# Altium schematic sheet Tray2_Comms.SchDoc
size A4
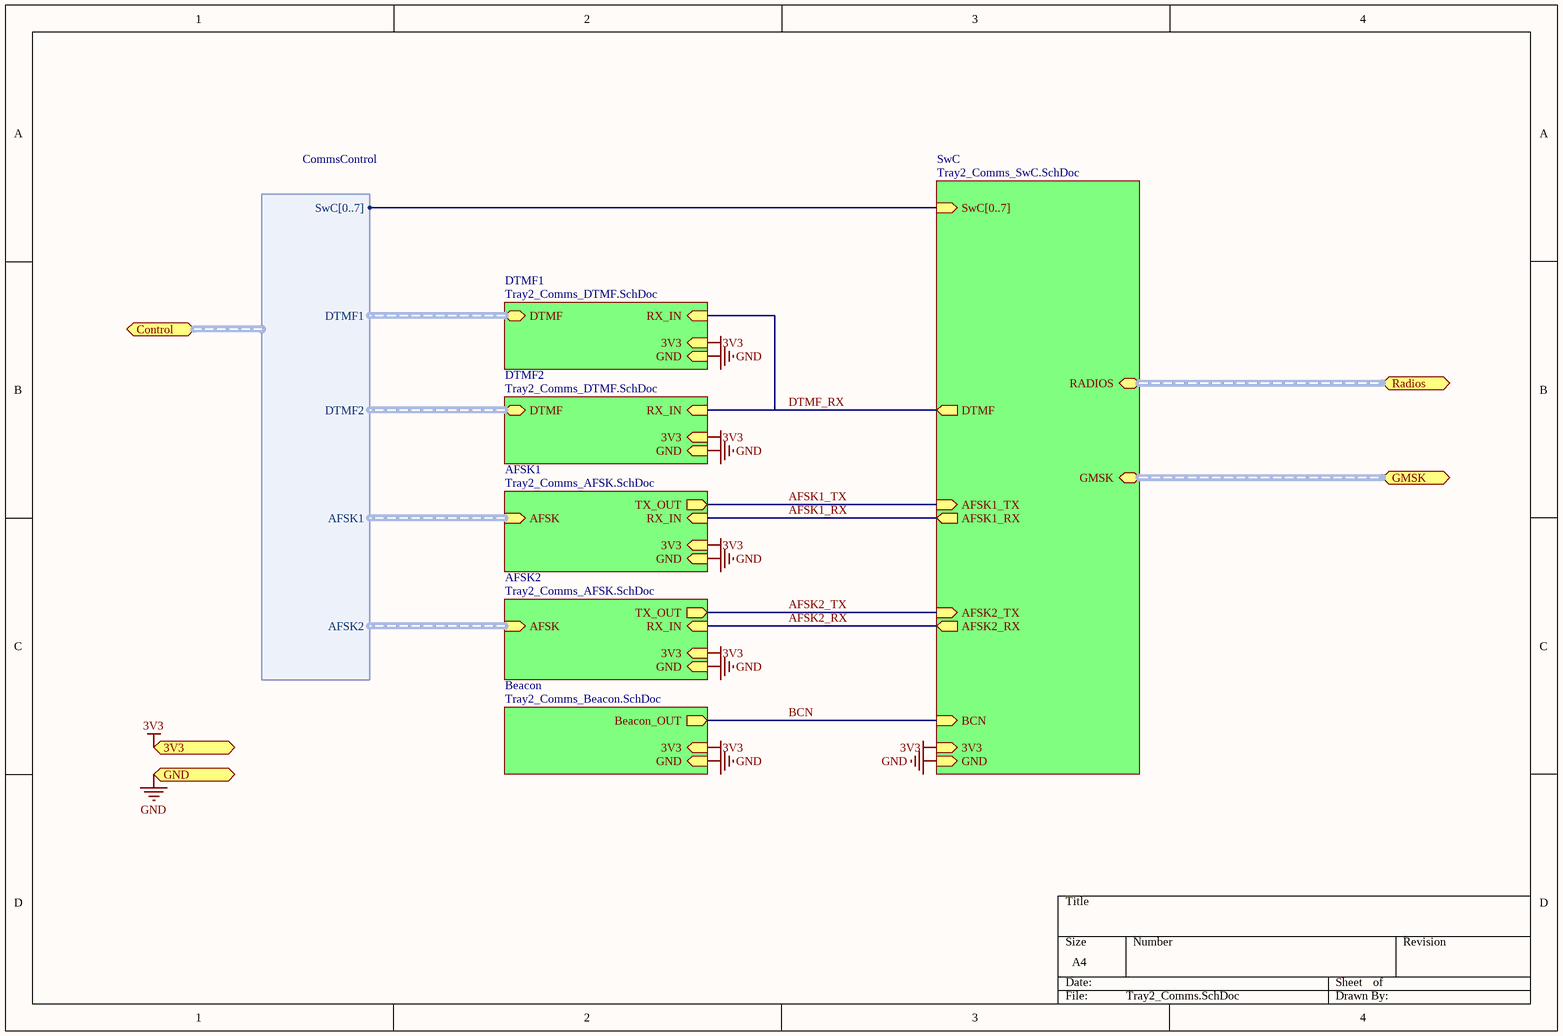
[diagram p0: Tray2_Comms.SchDoc]

## Sub-sheets
AFSK1 = Tray2_Comms_AFSK.SchDoc: RX_IN (in), AFSK (harness AFSK), TX_OUT (out), 3V3 (in), GND (in)
AFSK2 = Tray2_Comms_AFSK.SchDoc: RX_IN (in), AFSK (harness AFSK), TX_OUT (out), 3V3 (in), GND (in)
Beacon = Tray2_Comms_Beacon.SchDoc: Beacon_OUT (out), 3V3 (in), GND (in)
DTMF1 = Tray2_Comms_DTMF.SchDoc: RX_IN (in), DTMF (harness DTMF), 3V3 (in), GND (in)
DTMF2 = Tray2_Comms_DTMF.SchDoc: RX_IN (in), DTMF (harness DTMF), 3V3 (in), GND (in)
SwC = Tray2_Comms_SwC.SchDoc: BCN (in), AFSK1_TX (in), AFSK2_TX (in), AFSK1_RX (out), AFSK2_RX (out), DTMF (out), SwC[0..7] (in), RADIOS (harness Radios), GMSK (harness GMSK), 3V3 (in), GND (in)

## Ports
3V3 (in), Control (harness CommsControl), GMSK (harness GMSK), GND (in), Radios (harness Radios)

## Harnesses
CommsControl: DTMF1, DTMF2, AFSK1, AFSK2, SwC[0..7]

## Nets
3V3: port 3V3, sheet DTMF1/3V3, sheet DTMF2/3V3, sheet Beacon/3V3, sheet SwC/3V3, sheet AFSK1/3V3, sheet AFSK2/3V3
GND: port GND, sheet DTMF1/GND, sheet DTMF2/GND, sheet Beacon/GND, sheet SwC/GND, sheet AFSK1/GND, sheet AFSK2/GND
AFSK1_RX: sheet SwC/AFSK1_RX, sheet AFSK1/RX_IN
AFSK1_TX: sheet SwC/AFSK1_TX, sheet AFSK1/TX_OUT
AFSK2_RX: sheet SwC/AFSK2_RX, sheet AFSK2/RX_IN
AFSK2_TX: sheet SwC/AFSK2_TX, sheet AFSK2/TX_OUT
BCN: sheet Beacon/Beacon_OUT, sheet SwC/BCN
DTMF_RX: sheet DTMF1/RX_IN, sheet DTMF2/RX_IN, sheet SwC/DTMF

## Buses and harness runs
harness port GMSK = sheet SwC/GMSK
harness port Radios = sheet SwC/RADIOS